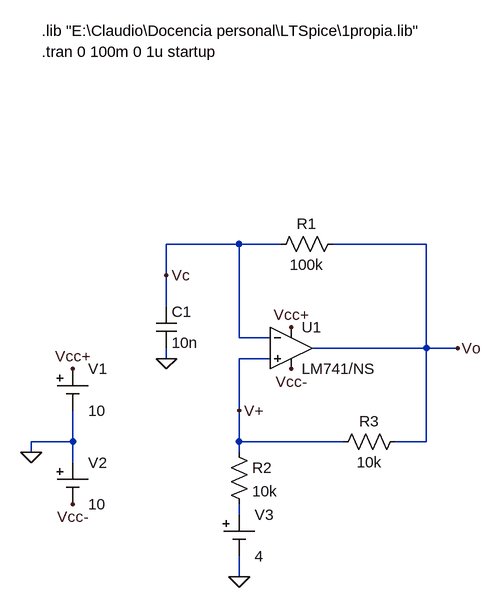
[diagram p0: schematic p2e3.asc]
p2e3.asc, the LTspice schematic file:
Version 4
SHEET 1 1140 680
WIRE 32 -160 -80 -160
WIRE 96 -160 32 -160
WIRE 320 -160 176 -160
WIRE -80 -112 -80 -160
WIRE -80 -64 -80 -112
WIRE 32 -16 32 -160
WIRE 80 -16 32 -16
WIRE 320 0 320 -160
WIRE 320 0 144 0
WIRE 368 0 320 0
WIRE -80 16 -80 0
WIRE 80 16 32 16
WIRE 32 96 32 16
WIRE -224 144 -224 96
WIRE -224 144 -288 144
WIRE 32 144 32 96
WIRE 192 144 32 144
WIRE 320 144 320 0
WIRE 320 144 272 144
WIRE -288 160 -288 144
WIRE 32 160 32 144
WIRE -224 176 -224 144
WIRE 32 256 32 240
WIRE 32 352 32 320
FLAG 112 -32 Vcc+
FLAG 112 32 Vcc-
FLAG -80 16 0
FLAG 32 352 0
FLAG -288 160 0
FLAG -224 32 Vcc+
FLAG -224 240 Vcc-
FLAG 368 0 Vo
FLAG -80 -112 Vc
FLAG 32 96 V+
SYMBOL OpAmps\\opamp2 112 -64 R0
SYMATTR InstName U1
SYMATTR Value LM741/NS
SYMBOL res 192 -176 R90
WINDOW 0 0 56 VBottom 2
WINDOW 3 32 56 VTop 2
SYMATTR InstName R1
SYMATTR Value 100k
SYMBOL cap -96 -64 R0
SYMATTR InstName C1
SYMATTR Value 10n
SYMBOL res 16 144 R0
SYMATTR InstName R2
SYMATTR Value 10k
SYMBOL res 288 128 R90
WINDOW 0 0 56 VBottom 2
WINDOW 3 32 56 VTop 2
SYMATTR InstName R3
SYMATTR Value 10k
SYMBOL Misc\\cell -224 32 R0
WINDOW 123 0 0 Left 0
WINDOW 39 0 0 Left 0
SYMATTR InstName V1
SYMATTR Value 10
SYMBOL Misc\\cell -224 176 R0
WINDOW 123 0 0 Left 0
WINDOW 39 0 0 Left 0
SYMATTR InstName V2
SYMATTR Value 10
SYMBOL Misc\\cell 32 256 R0
WINDOW 123 0 0 Left 0
WINDOW 39 0 0 Left 0
SYMATTR InstName V3
SYMATTR Value 4
TEXT -272 -488 Left 2 !.lib "E:\\Claudio\\Docencia personal\\LTSpice\\1propia.lib"
TEXT -272 -456 Left 2 !.tran 0 100m 0 1u startup

The netlist it stands for:
* p2e3.asc
XU1 V+ Vc Vcc+ Vcc- Vo LM741/NS  ; pins In+ In- V+ V- OUT
R1 Vo Vc 100k
C1 Vc 0 10n
R2 V+ N001 10k
R3 Vo V+ 10k
V1 Vcc+ 0 10
V2 0 Vcc- 10
V3 N001 0 4
.lib "E:\Claudio\Docencia personal\LTSpice\1propia.lib"
.tran 0 100m 0 1u startup
.backanno
.end